# Altium schematic sheet Ethernet.SchDoc
size A4
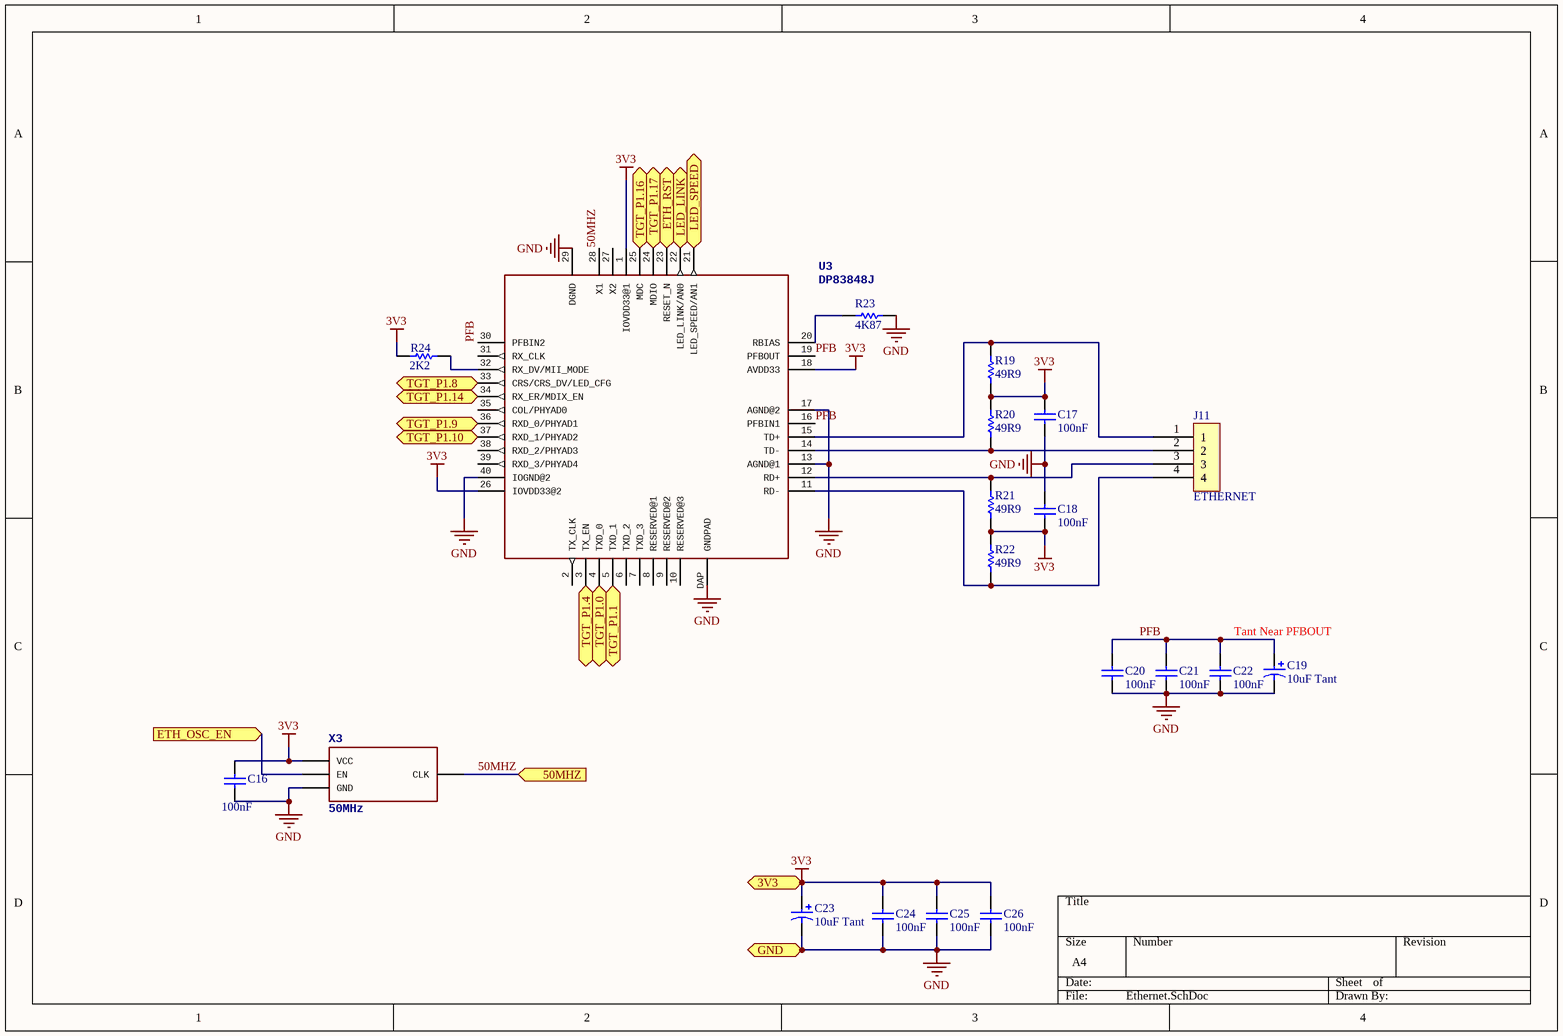
[diagram p0: Ethernet.SchDoc]

## Parts
C16  100nF  [CAPC0603(1608)100_L]
C17  100nF  [CAPC0603(1608)100_L]
C18  100nF  [CAPC0603(1608)100_L]
C19  10uF Tant  [CAPMP3528X12N]
C20  100nF  [CAPC0603(1608)100_L]
C21  100nF  [CAPC0603(1608)100_L]
C22  100nF  [CAPC0603(1608)100_L]
C23  10uF Tant  [CAPMP3528X12N]
C24  100nF  [CAPC0603(1608)100_L]
C25  100nF  [CAPC0603(1608)100_L]
C26  100nF  [CAPC0603(1608)100_L]
J11  ETHERNET  [MICRO-MATCH-4]
R19  49R9  [RESC0603(1608)_L]
R20  49R9  [RESC0603(1608)_L]
R21  49R9  [RESC0603(1608)_L]
R22  49R9  [RESC0603(1608)_L]
R23  4K87  [RESC0603(1608)_L]
R24  2K2  [RESC0603(1608)_L]
U3  DP83848J  [LLP-40]
X3  50MHz  [3.2X.2.5]

## Ports
3V3, 50MHZ (in), ETH_OSC_EN (in), ETH_RST (in), GND, LED_LINK (out), LED_SPEED (out), TGT_P1.0 (in), TGT_P1.1 (in), TGT_P1.4 (in), TGT_P1.8 (out), TGT_P1.9 (out), TGT_P1.10 (out), TGT_P1.14 (out), TGT_P1.16 (in), TGT_P1.17 (bidir)

## Nets
3V3: C16.2 C17.2 C18.1 C23.2 C24.2 C25.2 C26.2 R19.1 R20.2 R21.1 R22.2 R24.1 U3.1(IOVDD33@1) U3.18(AVDD33) U3.26(IOVDD33@2) X3.P$4(VCC) ; port 3V3
GND: C16.1 C17.1 C18.2 C19.1 C20.1 C21.2 C22.2 C23.1 C24.1 C25.1 C26.1 R23.2 U3.13(AGND@1) U3.17(AGND@2) U3.29(DGND) U3.40(IOGND@2) U3.DAP(GNDPAD) X3.P$2(GND) ; port GND
50MHZ: U3.28(X1) X3.P$3(CLK) ; port 50MHZ
ETH_OSC_EN: X3.P$1(EN) ; port ETH_OSC_EN
ETH_RST: U3.23(RESET_N) ; port ETH_RST
LED_LINK: U3.22(LED_LINK/AN0) ; port LED_LINK
LED_SPEED: U3.21(LED_SPEED/AN1) ; port LED_SPEED
PFB: C19.2 C20.2 C21.1 C22.1 U3.16(PFBIN1) U3.19(PFBOUT) U3.30(PFBIN2)
TGT_P1.0: U3.4(TXD_0) ; port TGT_P1.0
TGT_P1.1: U3.5(TXD_1) ; port TGT_P1.1
TGT_P1.4: U3.3(TX_EN) ; port TGT_P1.4
TGT_P1.8: U3.33(CRS/CRS_DV/LED_CFG) ; port TGT_P1.8
TGT_P1.9: U3.36(RXD_0/PHYAD1) ; port TGT_P1.9
TGT_P1.10: U3.37(RXD_1/PHYAD2) ; port TGT_P1.10
TGT_P1.14: U3.34(RX_ER/MDIX_EN) ; port TGT_P1.14
TGT_P1.16: U3.25(MDC) ; port TGT_P1.16
TGT_P1.17: U3.24(MDIO) ; port TGT_P1.17
NetJ11_1: J11.1 R19.2 U3.15(TD+)
NetJ11_2: J11.2 R20.1 U3.14(TD-)
NetJ11_3: J11.3 R21.2 U3.12(RD+)
NetJ11_4: J11.4 R22.1 U3.11(RD-)
NetR23_1: R23.1 U3.20(RBIAS)
NetR24_2: R24.2 U3.32(RX_DV/MII_MODE)

Not connected (* = marked no-connect by the designer): U3 2(TX_CLK) 6(TXD_2) 7(TXD_3) 8(RESERVED@1) 9(RESERVED@2) 10(RESERVED@3) 27(X2) 31(RX_CLK) 35(COL/PHYAD0) 38(RXD_2/PHYAD3) 39(RXD_3/PHYAD4)

## Notes on the sheet
- Tant Near PFBOUT

## Library data of the parts
C16-C18 C20-C22 C24-C26 = CMP-1035-02575-1: CAP 100nF 6.3V ±5% 0603 (1608 Metric) Thickness 1mm SMD; Tolerance: Â±5%; Case-Metric: 1608; Case-EIA: 0603; Technology: SMT; Rated Voltage: 6.3 V; Max Thickness: 1 mm; Value: 100nF
C19 C23 = cap_pol
J11 = HEADER-4
R19-R22 = CMP-1012-00363-1: 49R9 0.1W 1% 0603 (1608 Metric)  SMD; Case-Metric: 1608; Case-EIA: 0603; Value: 49.90 Ohm; Power: 0.1 W; Tolerance: 1 %; Technology: SMT
R23 = CMP-1012-00588-1: 4K87 0.1W 1% 0603 (1608 Metric)  SMD; Case-EIA: 0603; Case-Metric: 1608; Value: 4870.00 Ohm; Power: 0.1 W; Technology: SMT; Tolerance: 1 %
R24 = CMP-1012-00546-1: 2K2 0.1W 1% 0603 (1608 Metric)  SMD; Case-EIA: 0603; Value: 2200.00 Ohm; Case-Metric: 1608; Tolerance: 1 %; Power: 0.1 W; Technology: SMT
X3 = OSCILLATOR